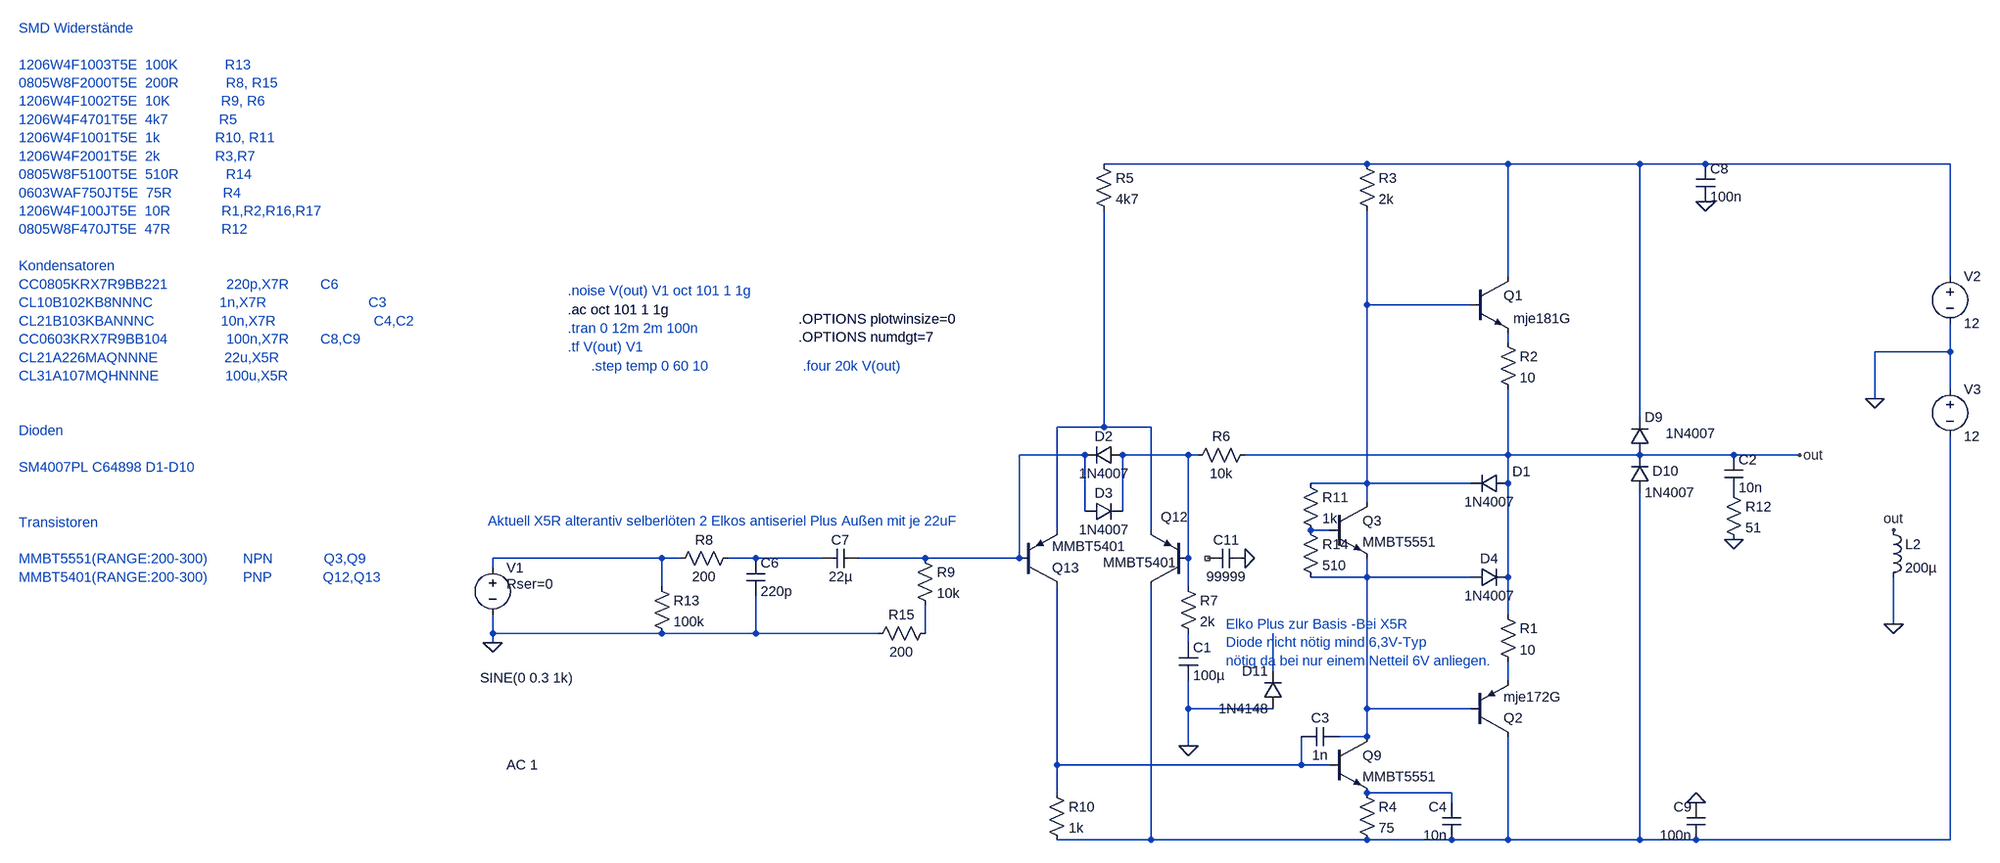
[diagram p0: schematic Easy-Amp-B2.asc]
Easy-Amp-B2.asc, the LTspice schematic file:
Version 4.1
SHEET 1 2840 948
WIRE 1136 -432 688 -432
WIRE 1376 -432 1136 -432
WIRE 1600 -432 1376 -432
WIRE 1712 -432 1600 -432
WIRE 2128 -432 1712 -432
WIRE 1376 -240 1376 -432
WIRE 2128 -240 2128 -432
WIRE 1136 -192 1136 -352
WIRE 1312 -192 1136 -192
WIRE 1376 -128 1376 -144
WIRE 2128 -112 2128 -160
WIRE 2128 -112 2000 -112
WIRE 2128 -48 2128 -112
WIRE 2000 -32 2000 -112
WIRE 1600 0 1600 -432
WIRE 688 16 688 -352
WIRE 688 16 608 16
WIRE 768 16 688 16
WIRE 656 64 544 64
WIRE 832 64 720 64
WIRE 848 64 832 64
WIRE 1376 64 1376 -48
WIRE 1376 64 928 64
WIRE 1600 64 1376 64
WIRE 1760 64 1600 64
WIRE 1872 64 1760 64
WIRE 1136 112 1136 -192
WIRE 1136 112 1040 112
WIRE 1312 112 1136 112
WIRE 1376 112 1376 64
WIRE 1136 144 1136 112
WIRE 656 160 656 64
WIRE 720 160 720 64
WIRE 608 192 608 16
WIRE 768 192 768 16
WIRE 1072 192 1040 192
WIRE -64 240 -352 240
WIRE -32 240 -64 240
WIRE 96 240 48 240
WIRE 208 240 96 240
WIRE 384 240 272 240
WIRE 544 240 544 64
WIRE 544 240 384 240
WIRE 832 240 832 64
WIRE -352 256 -352 240
WIRE 1136 272 1136 240
WIRE 1136 272 1040 272
WIRE 1312 272 1136 272
WIRE 1376 272 1376 112
WIRE -64 288 -64 240
WIRE 832 288 832 240
WIRE 1376 336 1376 272
WIRE 2032 352 2032 272
WIRE -352 368 -352 336
WIRE -64 368 -352 368
WIRE 96 368 96 304
WIRE 96 368 -64 368
WIRE 304 368 96 368
WIRE 384 368 384 320
WIRE -352 384 -352 368
WIRE 832 384 832 368
WIRE 976 432 976 368
WIRE 1376 448 1376 416
WIRE 832 496 832 448
WIRE 976 496 832 496
WIRE 1136 496 1136 272
WIRE 1312 496 1136 496
WIRE 1136 544 1136 496
WIRE 1136 544 1088 544
WIRE 832 560 832 496
WIRE 608 592 608 288
WIRE 1024 592 1024 544
WIRE 1024 592 608 592
WIRE 1072 592 1024 592
WIRE 608 640 608 592
WIRE 1280 640 1136 640
WIRE 1280 656 1280 640
WIRE 768 720 768 288
WIRE 768 720 608 720
WIRE 1136 720 768 720
WIRE 1280 720 1136 720
WIRE 1376 720 1376 544
WIRE 1376 720 1280 720
WIRE 1600 720 1600 128
WIRE 1600 720 1376 720
WIRE 1696 720 1600 720
WIRE 2128 720 2128 32
WIRE 2128 720 1696 720
FLAG -352 384 0
FLAG 2000 -32 0
FLAG 2032 352 0
FLAG 832 560 0
FLAG 1872 64 out
FLAG 1760 208 0
FLAG 1712 -368 0
FLAG 1696 656 0
FLAG 2032 192 out
FLAG 928 240 0
SYMBOL npn 1312 -240 R0
WINDOW 3 73 71 Left 2
SYMATTR Value mje181G
SYMATTR InstName Q1
SYMBOL pnp 1312 544 M180
SYMATTR InstName Q2
SYMATTR Value mje172G
SYMBOL res 1360 -144 R0
SYMATTR InstName R2
SYMATTR Value 10
SYMBOL npn 1072 544 R0
SYMATTR InstName Q9
SYMATTR Value MMBT5551
SYMBOL res 1120 -448 R0
SYMATTR InstName R3
SYMATTR Value 2k
SYMBOL res 1120 624 R0
SYMATTR InstName R4
SYMATTR Value 75
SYMBOL pnp 832 288 R180
WINDOW 0 1 118 Left 2
WINDOW 3 20 41 Left 2
SYMATTR InstName Q12
SYMATTR Value MMBT5401
SYMBOL pnp 544 288 M180
SYMATTR InstName Q13
SYMATTR Value MMBT5401
SYMBOL diode 720 48 R90
WINDOW 0 0 32 VBottom 2
WINDOW 3 32 32 VTop 2
SYMATTR InstName D2
SYMATTR Value 1N4007
SYMBOL diode 656 176 R270
WINDOW 0 32 32 VTop 2
WINDOW 3 0 32 VBottom 2
SYMATTR InstName D3
SYMATTR Value 1N4007
SYMBOL res 592 624 R0
SYMATTR InstName R10
SYMATTR Value 1k
SYMBOL voltage -352 240 R0
WINDOW 123 24 352 Left 2
WINDOW 39 24 44 Left 2
WINDOW 3 -21 204 Left 2
SYMATTR Value2 AC 1
SYMATTR SpiceLine Rser=0
SYMATTR Value SINE(0 0.3 1k)
SYMATTR InstName V1
SYMBOL voltage 2128 -256 R0
WINDOW 123 24 44 Left 2
WINDOW 39 24 44 Left 2
SYMATTR InstName V2
SYMATTR Value 12
SYMBOL voltage 2128 -64 R0
WINDOW 123 24 124 Left 2
WINDOW 39 24 124 Left 2
SYMATTR InstName V3
SYMATTR Value 12
SYMBOL res 672 -448 R0
SYMATTR InstName R5
SYMATTR Value 4k7
SYMBOL res 944 48 R90
WINDOW 0 0 56 VBottom 2
WINDOW 3 32 56 VTop 2
SYMATTR InstName R6
SYMATTR Value 10k
SYMBOL cap 816 384 R0
SYMATTR InstName C1
SYMATTR Value 100µ
SYMATTR SpiceLine V=63 Irms=365m Rser=0.25 Lser=0
SYMBOL cap 1088 528 R90
WINDOW 0 0 32 VBottom 2
WINDOW 3 32 32 VTop 2
SYMATTR InstName C3
SYMATTR Value 1n
SYMBOL res 816 272 R0
SYMATTR InstName R7
SYMATTR Value 2k
SYMBOL diode 1376 96 R90
WINDOW 0 12 -23 VBottom 2
WINDOW 3 32 32 VTop 2
SYMATTR InstName D1
SYMATTR Value 1N4007
SYMBOL diode 1312 288 R270
WINDOW 0 32 32 VTop 2
WINDOW 3 0 32 VBottom 2
SYMATTR InstName D4
SYMATTR Value 1N4007
SYMBOL res 64 224 R90
WINDOW 0 0 56 VBottom 2
WINDOW 3 32 56 VTop 2
SYMATTR InstName R8
SYMATTR Value 200
SYMBOL res 368 224 R0
SYMATTR InstName R9
SYMATTR Value 10k
SYMBOL cap 80 240 R0
SYMATTR InstName C6
SYMATTR Value 220p
SYMBOL res 1744 112 R0
SYMATTR InstName R12
SYMATTR Value 51
SYMBOL ind 2016 176 R0
SYMATTR InstName L2
SYMATTR Value 200µ
SYMATTR SpiceLine Rser=200 Cpar=10p
SYMBOL diode 1584 64 M180
WINDOW 0 24 64 Left 2
WINDOW 3 60 37 Left 2
SYMATTR InstName D9
SYMATTR Value 1N4007
SYMBOL diode 1584 128 M180
WINDOW 0 38 37 Left 2
WINDOW 3 24 0 Left 2
SYMATTR InstName D10
SYMATTR Value 1N4007
SYMBOL res -80 272 R0
SYMATTR InstName R13
SYMATTR Value 100k
SYMBOL diode 992 496 R180
WINDOW 0 24 64 Left 2
WINDOW 3 24 0 Left 2
SYMATTR InstName D11
SYMATTR Value 1N4148
SYMBOL cap 1696 -432 R0
SYMATTR InstName C8
SYMATTR Value 100n
SYMBOL cap 1712 720 R180
WINDOW 0 24 56 Left 2
WINDOW 3 24 8 Left 2
SYMATTR InstName C9
SYMATTR Value 100n
SYMBOL cap 1744 64 R0
SYMATTR InstName C2
SYMATTR Value 10n
SYMBOL cap 1296 720 R180
WINDOW 0 24 56 Left 2
WINDOW 3 24 8 Left 2
SYMATTR InstName C4
SYMATTR Value 10n
SYMBOL res 400 352 R90
WINDOW 0 0 56 VBottom 2
WINDOW 3 32 56 VTop 2
SYMATTR InstName R15
SYMATTR Value 200
SYMBOL cap 272 224 R90
WINDOW 0 0 32 VBottom 2
WINDOW 3 32 32 VTop 2
SYMATTR InstName C7
SYMATTR Value 22µ
SYMBOL npn 1072 144 R0
SYMATTR InstName Q3
SYMATTR Value MMBT5551
SYMBOL res 1024 96 R0
SYMATTR InstName R11
SYMATTR Value 1k
SYMBOL res 1024 176 R0
SYMATTR InstName R14
SYMATTR Value 510
SYMBOL cap 928 224 R90
WINDOW 0 0 32 VBottom 2
WINDOW 3 32 32 VTop 2
SYMATTR InstName C11
SYMATTR Value 99999
SYMBOL res 1360 320 R0
SYMATTR InstName R1
SYMATTR Value 10
TEXT -224 -216 Left 2 ;.noise V(out) V1 oct 101 1 1g
TEXT 168 -168 Left 2 !.OPTIONS plotwinsize=0\n.OPTIONS numdgt=7
TEXT -224 -184 Left 2 !.ac oct 101 1 1g
TEXT -224 -152 Left 2 ;.tran 0 12m 2m 100n
TEXT -184 -88 Left 2 ;.step temp 0 60 10
TEXT 176 -88 Left 2 ;.four 20k V(out)
TEXT -224 -120 Left 2 ;.tf V(out) V1
TEXT -360 176 Left 2 ;Aktuell X5R alterantiv selberlöten 2 Elkos antiseriel Plus Außen mit je 22uF
TEXT 896 352 Left 2 ;Elko Plus zur Basis -Bei X5R\nDiode nicht nötig mind 6,3V-Typ\nnötig da bei nur einem Netteil 6V anliegen.
TEXT -1160 -664 Left 2 ;SMD Widerstände\n \n1206W4F1003T5E  100K            R13\n0805W8F2000T5E  200R            R8, R15\n1206W4F1002T5E  10K             R9, R6\n1206W4F4701T5E  4k7             R5\n1206W4F1001T5E  1k              R10, R11\n1206W4F2001T5E  2k              R3,R7\n0805W8F5100T5E  510R            R14\n0603WAF750JT5E  75R             R4\n1206W4F100JT5E  10R             R1,R2,R16,R17\n0805W8F470JT5E  47R             R12\n \nKondensatoren\nCC0805KRX7R9BB221               220p,X7R        C6\nCL10B102KB8NNNC                 1n,X7R                          C3\nCL21B103KBANNNC                 10n,X7R                         C4,C2\nCC0603KRX7R9BB104               100n,X7R        C8,C9\nCL21A226MAQNNNE                 22u,X5R                         \nCL31A107MQHNNNE                 100u,X5R        \n \n \nDioden\n \nSM4007PL C64898 D1-D10\n \n \nTransistoren\n \nMMBT5551(RANGE:200-300)         NPN             Q3,Q9\nMMBT5401(RANGE:200-300)         PNP             Q12,Q13

The netlist it stands for:
* Easy-Amp-B2.asc
Q1 N001 N002 N003 0 mje181G
Q2 N017 N010 N014 0 mje172G
R2 N003 out 10
Q9 N010 N015 N016 0 MMBT5551
R3 N001 N002 2k
R4 N016 N017 75
Q12 N017 N006 N004 0 MMBT5401
Q13 N015 N005 N004 0 MMBT5401
D2 N006 N005 1N4007
D3 N005 N006 1N4007
R10 N015 N017 1k
V1 N008 0 SINE(0 0.3 1k) AC 1 Rser=0
V2 N001 0 12
V3 0 N017 12
R5 N001 N004 4k7
R6 out N006 10k
C1 N012 0 100µ V=63 Irms=365m Rser=0.25 Lser=0
C3 N010 N015 1n
R7 N006 N012 2k
D1 out N002 1N4007
D4 N010 out 1N4007
R8 N009 N008 200
R9 N005 N011 10k
C6 N009 0 220p
R12 P001 0 51
L2 out 0 200µ Rser=200 Cpar=10p
D9 out N001 1N4007
D10 N017 out 1N4007
R13 N008 0 100k
D11 0 N013 1N4148
C8 N001 0 100n
C9 N017 0 100n
C2 out P001 10n
C4 N017 N016 10n
R15 N011 0 200
C7 N005 N009 22µ
Q3 N002 N007 N010 0 MMBT5551
R11 N002 N007 1k
R14 N007 N010 510
C11 0 NC_01 99999
R1 out N014 10
.model D D
.lib standard.dio
.model NPN NPN
.model PNP PNP
.lib standard.bjt
* .noise V(out) V1 oct 101 1 1g
.OPTIONS plotwinsize=0
.OPTIONS numdgt=7
.ac oct 101 1 1g
* .tran 0 12m 2m 100n
* .step temp 0 60 10
* .four 20k V(out)
* .tf V(out) V1
* Aktuell X5R alterantiv selberlöten 2 Elkos antiseriel Plus Außen mit je 22uF
* Elko Plus zur Basis -Bei X5R
* Diode nicht nötig mind 6,3V-Typ
* nötig da bei nur einem Netteil 6V anliegen.
* SMD Widerstände
* 1206W4F1003T5E  100K            R13
* 0805W8F2000T5E  200R            R8, R15
* 1206W4F1002T5E  10K             R9, R6
* 1206W4F4701T5E  4k7             R5
* 1206W4F1001T5E  1k              R10, R11
* 1206W4F2001T5E  2k              R3,R7
* 0805W8F5100T5E  510R            R14
* 0603WAF750JT5E  75R             R4
* 1206W4F100JT5E  10R             R1,R2,R16,R17
* 0805W8F470JT5E  47R             R12
* Kondensatoren
* CC0805KRX7R9BB221               220p,X7R        C6
* CL10B102KB8NNNC                 1n,X7R                          C3
* CL21B103KBANNNC                 10n,X7R                         C4,C2
* CC0603KRX7R9BB104               100n,X7R        C8,C9
* CL21A226MAQNNNE                 22u,X5R
* CL31A107MQHNNNE                 100u,X5R
* Dioden
* SM4007PL C64898 D1-D10
* Transistoren
* MMBT5551(RANGE:200-300)         NPN             Q3,Q9
* MMBT5401(RANGE:200-300)         PNP             Q12,Q13
.backanno
.end